# Altium schematic sheet Snippet of Ethernet W5500.SchDoc
size A2
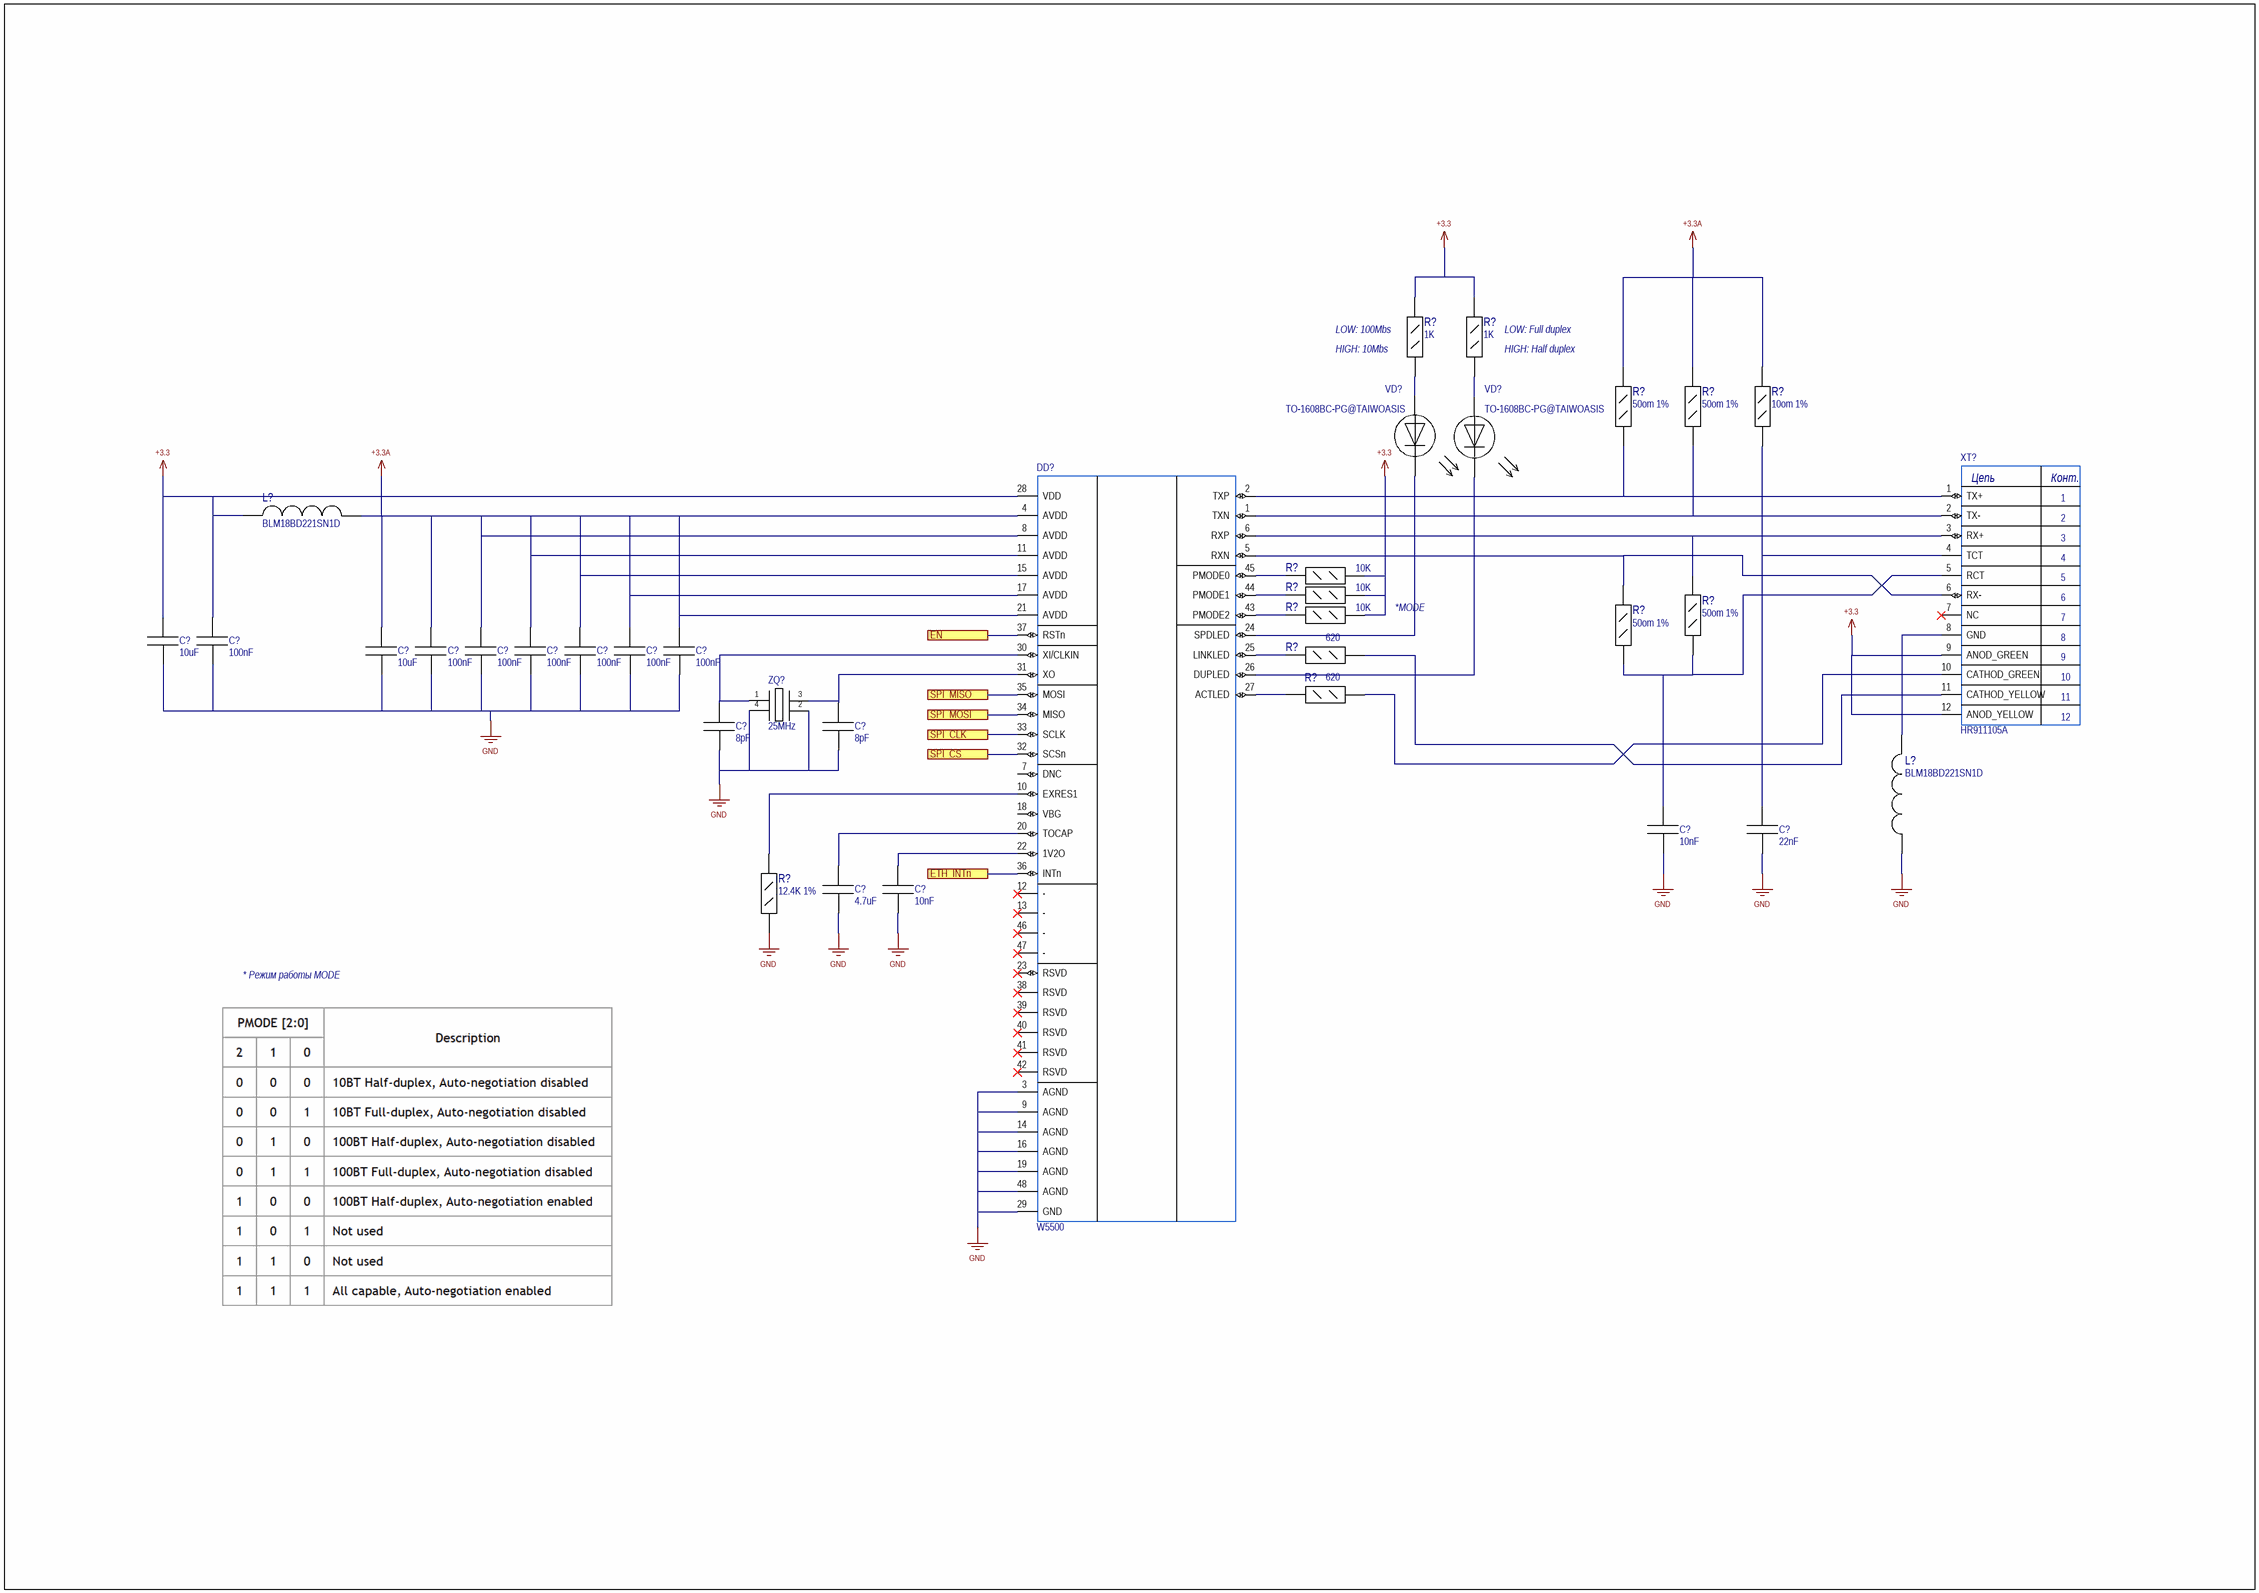
[diagram p0: Snippet of Ethernet W5500.SchDoc]

## Parts
(Parts that share a designator on the sheet are numbered #1, #2 ... from top to bottom, then left to right.)
C?#1  10uF  [CAP-0603]
C?#2  100nF  [CAP-0603]
C?#3  10uF  [CAP-0603]
C?#4  100nF  [CAP-0603]
C?#5  100nF  [CAP-0603]
C?#6  100nF  [CAP-0603]
C?#7  100nF  [CAP-0603]
C?#8  100nF  [CAP-0603]
C?#9  100nF  [CAP-0603]
C?#10  8pF  [CAP-0603]
C?#11  8pF  [CAP-0603]
C?#12  10nF  [CAP-0603]
C?#13  22nF  [CAP-0603]
C?#14  4.7uF  [CAP-0603]
C?#15  10nF  [CAP-0603]
DD?  W5500  [LQFP-48n]
L?#1  BLM18BD221SN1D
L?#2  BLM18BD221SN1D
R?#1  1K
R?#2  1K
R?#3  50om 1%
R?#4  50om 1%
R?#5  10om 1%
R?#6  10K
R?#7  10K
R?#8  10K
R?#9  50om 1%
R?#10  50om 1%
R?#11  620
R?#12  620
R?#13  12.4K 1%
VD?#1  TO-1608BC-PG@TAIWOASIS
VD?#2  TO-1608BC-PG@TAIWOASIS
XT?  HR911105A  [HR911105A]
ZQ?  25MHz

## Ports
EN, ETH_INTn, SPI_CLK, SPI_CS, SPI_MISO, SPI_MOSI

## Nets
+3.3: C?#1.2 C?#2.2 DD?.28(VDD) L?#1.1 R?#1.1 R?#2.1 R?#6.1 R?#7.1 R?#8.1 XT?.9(ANOD_GREEN) XT?.12(ANOD_YELLOW)
+3.3A: C?#3.2 C?#4.2 C?#5.2 C?#6.2 C?#7.2 C?#8.2 C?#9.2 DD?.4(AVDD) DD?.8(AVDD) DD?.11(AVDD) DD?.15(AVDD) DD?.17(AVDD) DD?.21(AVDD) L?#1.2 R?#3.2 R?#4.2 R?#5.2
GND: C?#1.1 C?#2.1 C?#3.1 C?#4.1 C?#5.1 C?#6.1 C?#7.1 C?#8.1 C?#9.1 C?#10.1 C?#11.1 C?#12.1 C?#13.1 C?#14.1 C?#15.1 DD?.3(AGND) DD?.9(AGND) DD?.14(AGND) DD?.16(AGND) DD?.19(AGND) DD?.29(GND) DD?.48(AGND) L?#2.1 R?#13.1 ZQ?.2 ZQ?.4
EN: DD?.37(RSTn) ; port EN
ETH_INTn: DD?.36(INTn) ; port ETH_INTn
SPI_CLK: DD?.33(SCLK) ; port SPI_CLK
SPI_CS: DD?.32(SCSn) ; port SPI_CS
SPI_MISO: DD?.35(MOSI) ; port SPI_MISO
SPI_MOSI: DD?.34(MISO) ; port SPI_MOSI
NetC?#10_2: C?#10.2 DD?.30(XI/CLKIN) ZQ?.1
NetC?#11_2: C?#11.2 DD?.31(XO) ZQ?.3
NetC?#12_2: C?#12.2 R?#9.1 R?#10.1 XT?.5(RCT)
NetC?#13_2: C?#13.2 R?#5.1 XT?.4(TCT)
NetC?#14_2: C?#14.2 DD?.20(TOCAP)
NetC?#15_2: C?#15.2 DD?.22(1V2O)
NetDD?_1: DD?.1(TXN) R?#4.1 XT?.2(TX-)
NetDD?_2: DD?.2(TXP) R?#3.1 XT?.1(TX+)
NetDD?_5: DD?.5(RXN) R?#10.2 XT?.6(RX-)
NetDD?_6: DD?.6(RXP) R?#9.2 XT?.3(RX+)
NetDD?_10: DD?.10(EXRES1) R?#13.2
NetDD?_24: DD?.24(SPDLED) VD?#1.2
NetDD?_25: DD?.25(LINKLED) R?#11.2
NetDD?_26: DD?.26(DUPLED) VD?#2.2
NetDD?_27: DD?.27(ACTLED) R?#12.2
NetDD?_43: DD?.43(PMODE2) R?#8.2
NetDD?_44: DD?.44(PMODE1) R?#7.2
NetDD?_45: DD?.45(PMODE0) R?#6.2
NetL?#2_2: L?#2.2 XT?.8(GND)
NetR?#1_2: R?#1.2 VD?#1.1
NetR?#2_2: R?#2.2 VD?#2.1
NetR?#11_1: R?#11.1 XT?.11(CATHOD_YELLOW)
NetR?#12_1: R?#12.1 XT?.10(CATHOD_GREEN)

Not connected (* = marked no-connect by the designer): DD? 7(DNC) 12(-)* 13(-)* 18(VBG) 23(RSVD)* 38(RSVD)* 39(RSVD)* 40(RSVD)* 41(RSVD)* 42(RSVD)* 46(-)* 47(-)*; XT? 7(NC)*

## Notes on the sheet
- (near R?#1) LOW: 100Mbs
- (near R?#2) LOW: Full duplex
- (near R?#1) HIGH: 10Mbs
- (near R?#2) HIGH: Half duplex
- *MODE
- * Режим работы MODE
- (in symbol Разъем RJ45 HR911105A) Цепь; Конт.

## Library data of the parts
C?#1-C?#15 = Конденсатор постоянной емкости: Capacitor; Part: *; Alternative part: *; ComponentLink1Description: Link; ComponentLink1URL: *; ComponentLink2Description: Alternative link; ComponentLink2URL: *
  C?#1 C?#3: Value: 10uF
  C?#2 C?#4-C?#9: Value: 100nF
  C?#10 C?#11: Value: 8pF
  C?#12 C?#15: Value: 10nF
  C?#13: Value: 22nF
  C?#14: Value: 4.7uF
DD? = W5500: Ethernet Controllers 2.97V ~ 3.63V 10/100 Base-T/TX PHY SPI LQFP-48_7x7x05P Ethernet ICs ROHS; Value: W5500; Part: *; Alternative part: *; ComponentLink1Description: Link; ComponentLink1URL: *; ComponentLink2Description: Alternative link; ComponentLink2URL: *
L?#1 L?#2 = Дроссель: Индуктивность; Value: BLM18BD221SN1D; Part: *; Alternative part: *; ComponentLink1Description: Link; ComponentLink1URL: *; ComponentLink2Description: Alternative link; ComponentLink2URL: *
R?#1 R?#2 = Резистор постоянный 0,125Вт: Part: RC0603JR-071KL @YAGEO; Alternative part: *; Value: 1K; ComponentLink1Description: Link; ComponentLink1URL: *; ComponentLink2Description: Alternative link; ComponentLink2URL: *
R?#3-R?#10 R?#13 = Резистор постоянный 0,125Вт: Part: *; Alternative part: *; ComponentLink1Description: Link; ComponentLink1URL: *; ComponentLink2Description: Alternative link; ComponentLink2URL: *
  R?#3 R?#4 R?#9 R?#10: Value: 50om 1%
  R?#5: Value: 10om 1%
  R?#6-R?#8: Value: 10K
  R?#13: Value: 12.4K 1%
R?#11 = Резистор постоянный 0,125Вт: Part: RC0603JR-07620RL; Alternative part: *; Value: 620; ComponentLink1Description: Link; ComponentLink1URL: *; ComponentLink2Description: Alternative link; ComponentLink2URL: *
R?#12 = Резистор постоянный 0,125Вт: Part: RC0603JR-07620RL"; Alternative part: *; Value: 620; ComponentLink1Description: Link; ComponentLink1URL: *; ComponentLink2Description: Alternative link; ComponentLink2URL: *
VD?#1 VD?#2 = Светодиод: Value: TO-1608BC-PG@TAIWOASIS; Part: *; Alternative part: *; ComponentLink1Description: Link; ComponentLink1URL: *; ComponentLink2Description: Alternative link; ComponentLink2URL: *
XT? = Разъем RJ45 HR911105A: RJ45; Value: HR911105A; Part: *; Alternative part: *; ComponentLink1Description: New link; ComponentLink1URL: *
ZQ? = Кварцевый резонатор 4 вывода: Кварцевый резонатор; Value: 25MHz; Part: *; Alternative part: *